# Altium schematic sheet FPGA_165B_DigitizedSound.SchDoc
size B; Organization: Altium Limited; Address1: L3, 12a Rodborough Rd; Address2: Frenchs Forest; Address3: NSW; Address4: Australia 2086; DocumentNumber: 1; SheetNumber: 1; SheetTotal: 8
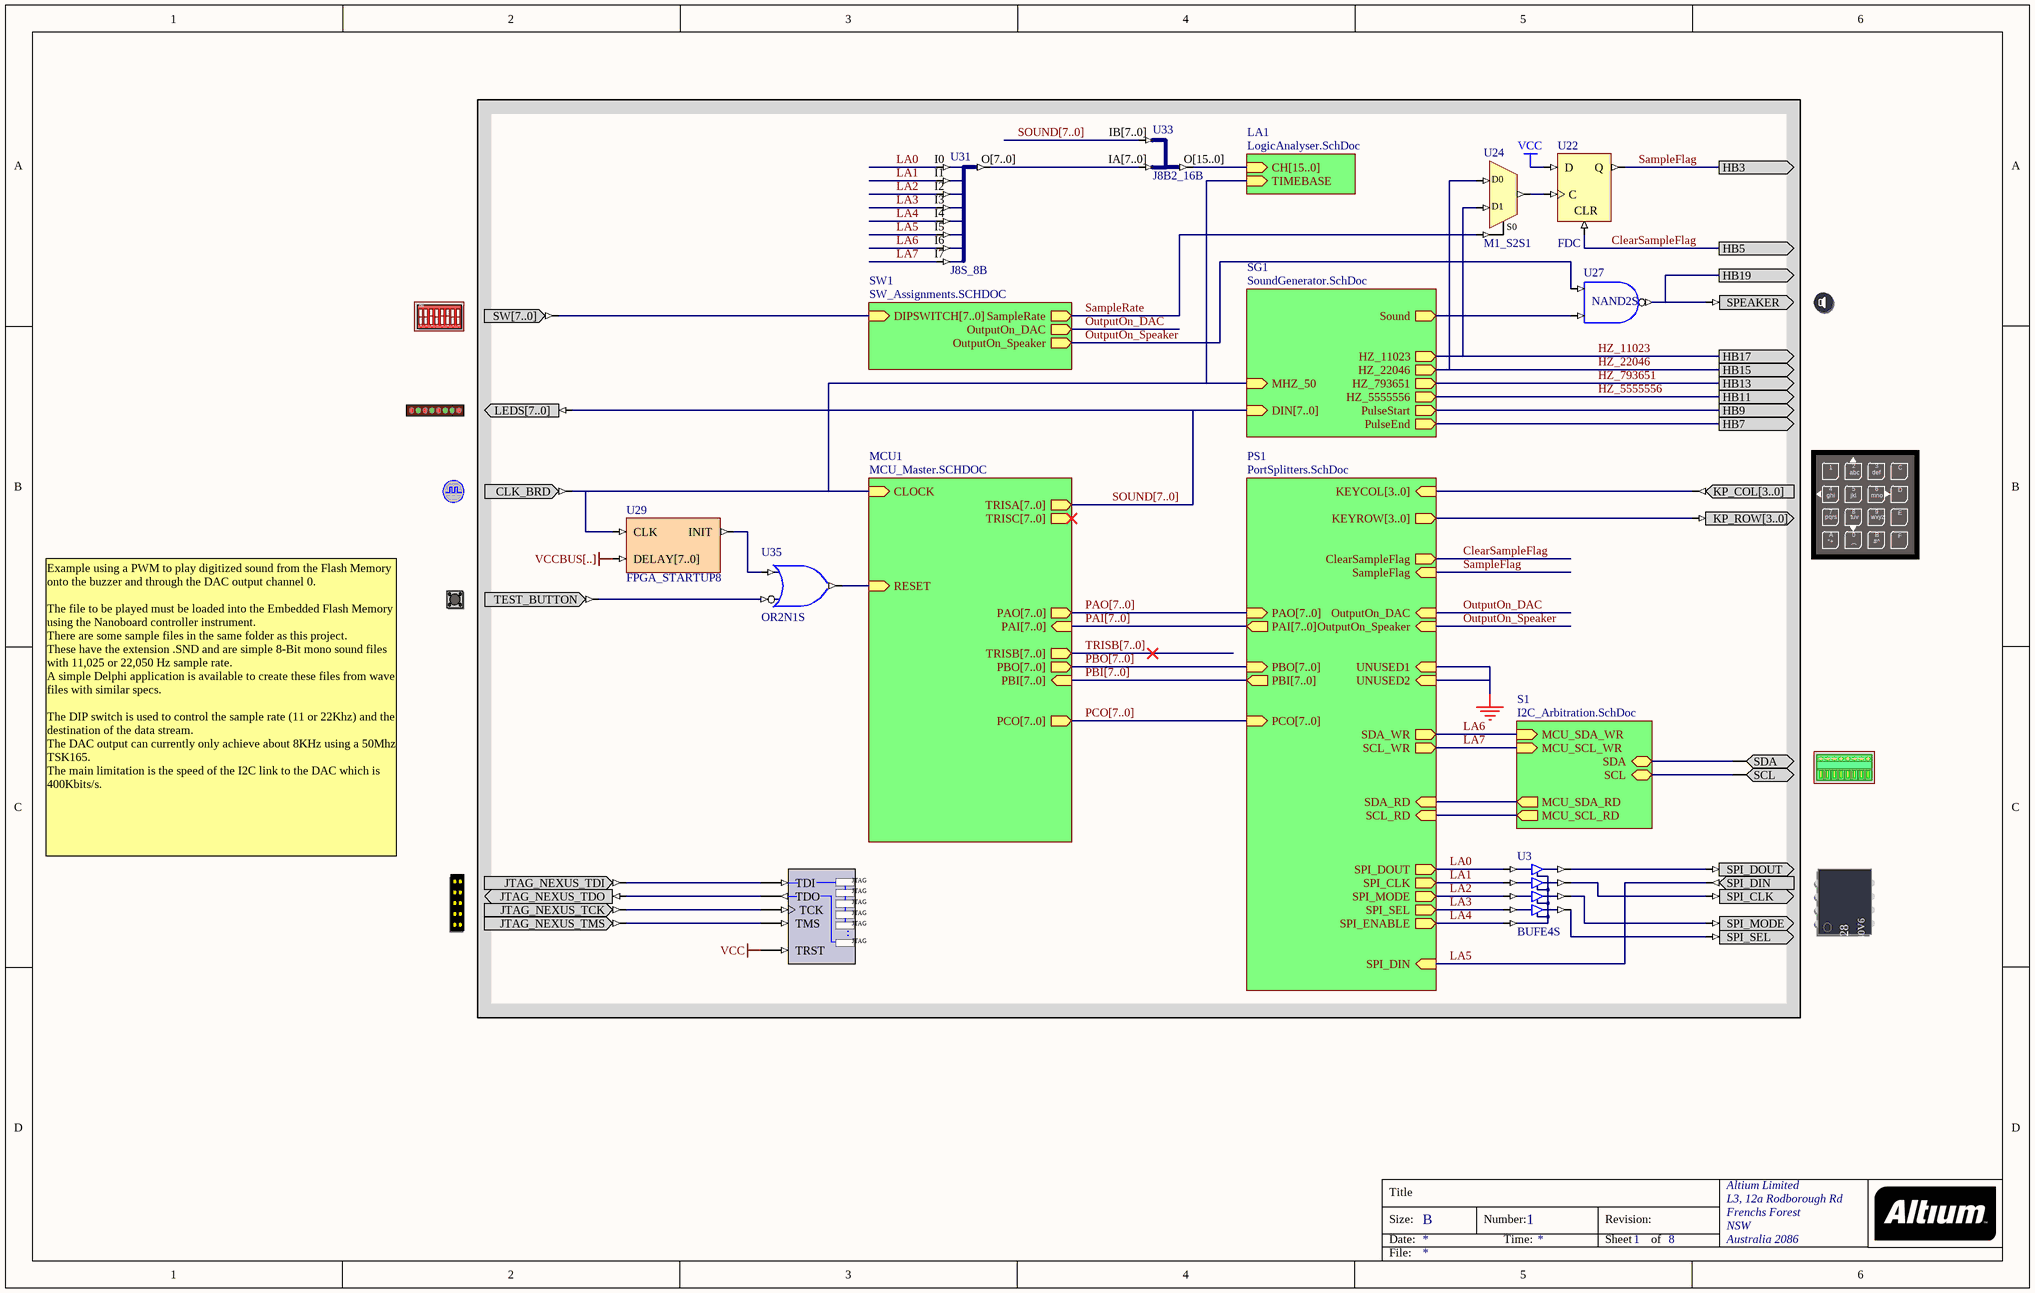
[diagram p0: FPGA_165B_DigitizedSound.SchDoc]

## Parts
(Parts that share a designator on the sheet are numbered #1, #2 ... from top to bottom, then left to right.)
?#1  SPEAKER  (value not drawn)
?#2  DIPSWITCH  (value not drawn)
?#3  LED  (value not drawn)
?#4  KEYPAD  (value not drawn)
?#5  CLOCK_BOARD  (value not drawn)
?#6  TEST_BUTTON  (value not drawn)
?#7  ADCDAC_I2C  (value not drawn)
?#8  SERIALFMEMORY  (value not drawn)
?#9  NEXUS_JTAG_CONNECTOR  (value not drawn)
NEXUS_JTAG_PORT  NEXUS_JTAG_PORT  (value not drawn)
U3  BUFE4S
U22  FDC
U24  M1_S2S1
U27  NAND2S
U29  FPGA_STARTUP8
U31  J8S_8B
U33  J8B2_16B
U35  OR2N1S

## Sub-sheets
LA1 = LogicAnalyser.SchDoc: CH[15..0] (in), TIMEBASE (in)
MCU1 = MCU_Master.SCHDOC: CLOCK (in), RESET (in), PAI[7..0] (in), PBI[7..0] (in), PAO[7..0] (out), TRISB[7..0] (out), PBO[7..0] (out), PCO[7..0] (out), TRISA[7..0] (out), TRISC[7..0] (out)
PS1 = PortSplitters.SchDoc: SDA_RD (in), SampleFlag (in), SCL_RD (in), OutputOn_DAC (in), OutputOn_Speaker (in), SPI_DIN (in), SDA_WR (out), SCL_WR (out), ClearSampleFlag (out), SPI_ENABLE (out), SPI_CLK (out), SPI_MODE (out), SPI_SEL (out), SPI_DOUT (out), PCO[7..0] (in), PBI[7..0] (out), UNUSED1 (in), UNUSED2 (in), PAI[7..0] (out), PAO[7..0] (in), PBO[7..0] (in), KEYCOL[3..0] (in), KEYROW[3..0] (out)
S1 = I2C_Arbitration.SchDoc: SDA (bidir), SCL (bidir), MCU_SCL_RD (out), MCU_SDA_WR (in), MCU_SCL_WR (in), MCU_SDA_RD (out)
SG1 = SoundGenerator.SchDoc: HZ_5555556 (out), Sound (out), HZ_22046 (out), HZ_793651 (out), PulseStart (out), PulseEnd (out), MHZ_50 (in), DIN[7..0] (in), HZ_11023 (out)
SW1 = SW_Assignments.SCHDOC: DIPSWITCH[7..0] (in), SampleRate (out), OutputOn_DAC (out), OutputOn_Speaker (out)

## Ports
HB3 (out), HB5 (out), HB7 (out), HB9 (out), HB11 (out), HB13 (out), HB15 (out), HB17 (out), HB19 (out)

## Nets
GND: sheet PS1/UNUSED1, sheet PS1/UNUSED2
VCC: NEXUS_JTAG_PORT.TRST U22.D
VCCBUS[..]: U29.DELAY[7..0]
ClearSampleFlag: U22.CLR ; port HB5, sheet PS1/ClearSampleFlag
HB7: port HB7, sheet SG1/PulseEnd
HB9: port HB9, sheet SG1/PulseStart
HB19: ?#1.SPEAKER U27.O ; port HB19
HZ_11023: U24.D1 ; port HB17, sheet SG1/HZ_11023
HZ_22046: U24.D0 ; port HB15, sheet SG1/HZ_22046
HZ_793651: port HB13, sheet SG1/HZ_793651
HZ_5555556: port HB11, sheet SG1/HZ_5555556
LA0: U3.I3 U31.I0 ; sheet PS1/SPI_DOUT
LA1: U3.I2 U31.I1 ; sheet PS1/SPI_CLK
LA2: U3.I1 U31.I2 ; sheet PS1/SPI_MODE
LA3: U3.I0 U31.I3 ; sheet PS1/SPI_SEL
LA4: U3.E U31.I4 ; sheet PS1/SPI_ENABLE
LA5: ?#8.SPI_DIN U31.I5 ; sheet PS1/SPI_DIN
LA6: U31.I6 ; sheet S1/MCU_SDA_WR, sheet PS1/SDA_WR
LA7: U31.I7 ; sheet S1/MCU_SCL_WR, sheet PS1/SCL_WR
OutputOn_DAC: sheet PS1/OutputOn_DAC, sheet SW1/OutputOn_DAC
OutputOn_Speaker: U27.I0 ; sheet PS1/OutputOn_Speaker, sheet SW1/OutputOn_Speaker
SampleFlag: U22.Q ; port HB3, sheet PS1/SampleFlag
SampleRate: U24.S0 ; sheet SW1/SampleRate
SOUND[7..0]: ?#3.LEDS[7..0] U33.IB[7..0] ; sheet SG1/DIN[7..0], sheet MCU1/TRISA[7..0]
Net?#2_SW[7..0]: ?#2.SW[7..0] ; sheet SW1/DIPSWITCH[7..0]
Net?#4_KP_COL[3..0]: ?#4.KP_COL[3..0] ; sheet PS1/KEYCOL[3..0]
Net?#4_KP_ROW[3..0]: ?#4.KP_ROW[3..0] ; sheet PS1/KEYROW[3..0]
Net?#5_CLK_BRD: ?#5.CLK_BRD U29.CLK ; sheet SG1/MHZ_50, sheet MCU1/CLOCK, sheet LA1/TIMEBASE
Net?#6_TEST_BUTTON: ?#6.TEST_BUTTON U35.I0
Net?#7_SCL: ?#7.SCL ; sheet S1/SCL
Net?#7_SDA: ?#7.SDA ; sheet S1/SDA
Net?#8_SPI_CLK: ?#8.SPI_CLK U3.O2
Net?#8_SPI_DOUT: ?#8.SPI_DOUT U3.O3
Net?#8_SPI_MODE: ?#8.SPI_MODE U3.O1
Net?#8_SPI_SEL: ?#8.SPI_SEL U3.O0
Net?#9_JTAG_NEXUS_TCK: ?#9.JTAG_NEXUS_TCK NEXUS_JTAG_PORT.TCK
Net?#9_JTAG_NEXUS_TDI: ?#9.JTAG_NEXUS_TDI NEXUS_JTAG_PORT.TDI
Net?#9_JTAG_NEXUS_TDO: ?#9.JTAG_NEXUS_TDO NEXUS_JTAG_PORT.TDO
Net?#9_JTAG_NEXUS_TMS: ?#9.JTAG_NEXUS_TMS NEXUS_JTAG_PORT.TMS
NetU22_C: U22.C U24.O
NetU27_I1: U27.I1 ; sheet SG1/Sound
NetU29_INIT: U29.INIT U35.I1
NetU31_O[7..0]: U31.O[7..0] U33.IA[7..0]
NetU33_O[15..0]: U33.O[15..0] ; sheet LA1/CH[15..0]
NetU35_O: U35.O ; sheet MCU1/RESET
(unnamed): sheet S1/MCU_SCL_RD, sheet PS1/SCL_RD
(unnamed): sheet S1/MCU_SDA_RD, sheet PS1/SDA_RD

## Buses and harness runs
bus PAI[7..0] = sheet MCU1/PAI[7..0] = sheet PS1/PAI[7..0]
bus PAO[7..0] = sheet MCU1/PAO[7..0] = sheet PS1/PAO[7..0]
bus PBI[7..0] = sheet MCU1/PBI[7..0] = sheet PS1/PBI[7..0]
bus PBO[7..0] = sheet MCU1/PBO[7..0] = sheet PS1/PBO[7..0]
bus PCO[7..0] = sheet MCU1/PCO[7..0] = sheet PS1/PCO[7..0]
bus SOUND[7..0]
bus SOUND[7..0] = sheet MCU1/TRISA[7..0] = sheet SG1/DIN[7..0]
bus TRISB[7..0] = sheet MCU1/TRISB[7..0]

## Notes on the sheet
- Example using a PWM to play digitized sound from the Flash Memory onto the buzzer and through the DAC output channel 0.
  The file to be played must be loaded into the Embedded Flash Memory using the Nanoboard controller instrument.
  There are some sample files in the same folder as this project.
  These have the extension .SND and are simple 8-Bit mono sound files with 11,025 or 22,050 Hz sample rate.
  A simple Delphi application is available to create these files from wave files with similar specs.
  The DIP switch is used to control the sample rate (11 or 22Khz) and the destination of the data stream.
  The DAC output can currently only achieve about 8KHz using a 50Mhz TSK165.
  The main limitation is the speed of the I2C link to the DAC which is 400Kbits/s.
- Title
- Size:
- Date:
- B
- Number:
- Time:
- Revision:
- Sheet
- of
- File:
- (in symbol DIPSWITCH) ON; 1; 2; 3; 4; 5; 6; 7; 8
- (in symbol KEYPAD) 1; 2; 3; C; abc; def; 4; 5; 6; ghi; jkl; mno; D; 7; 8; 9; E; pqrs; tuv; wxyz; A; 0; B; F; *+; (; #^
- (in symbol NEXUS_JTAG_PORT) JTAG; .
- (in symbol SERIALFMEMORY) 2SP40V6; ST 93228

## Library data of the parts
?#1 = SPEAKER: Sound interface; PortComponent: True; Published: 19-Nov-2003; Publisher: Altium Limited
?#2 = DIPSWITCH: 8-Way Dip Switch; PortComponent: True; Published: 19-Nov-2003; Publisher: Altium Limited
?#3 = LED: 8-Way LEDS; PortComponent: True; Published: 19-Nov-2003; Publisher: Altium Limited
?#4 = KEYPAD: Key Pad; PortComponent: True; Published: 19-Nov-2003; Publisher: Altium Limited
?#5 = CLOCK_BOARD: Global System Clock Supply; PortComponent: True; Published: 19-Nov-2003; Publisher: Altium Limited
?#6 = TEST_BUTTON: Test Button; PortComponent: True; Published: 19-Nov-2003; Publisher: Altium Limited
?#7 = ADCDAC_I2C: Analog Digital/ Digital Analog Converter, I2C Interface; PortComponent: True; Published: 19-Nov-2003; Publisher: Altium Limited
?#8 = SERIALFMEMORY: Serial Flash Memory; PortComponent: True; Published: 19-Nov-2003; Publisher: Altium Limited
?#9 = NEXUS_JTAG_CONNECTOR: JTAG Port; PortComponent: True; Published: 19-Nov-2003; Publisher: Altium Limited
NEXUS_JTAG_PORT = NEXUS_JTAG_PORT: Soft Nexus-Chain Connector; NEXUS_JTAG_CONNECTOR: True; Published: 18-Dec-2003; Publisher: Altium Limited
U3 = BUFE4S: 4-Bit 3-state Buffer with Active High Enable, Single Pin Version; Xilinx Equivalent: BUFE4; ArchiveName: GENERIC; Published: 18-Dec-2003; Publisher: Altium Limited; Core Revision: 1.00.00
U22 = FDC: D-Type Flip-Flop with Asynchronous Clear; ArchiveName: GENERIC; Published: 18-Dec-2003; Publisher: Altium Limited; Xilinx Equivalent: FDC; Core Revision: 1.00.00
U24 = M1_S2S1: 2x1-Single Wire to 1x1-Single Wire Multiplexer; Xilinx Equivalent: M2_1; ArchiveName: GENERIC; Published: 18-Nov-2003; Publisher: Altium Limited; Core Revision: 1.00.00
U27 = NAND2S: 2-Input NAND Gate, Single Pin Version; Xilinx Equivalent: NAND2; ArchiveName: GENERIC; Published: 18-Nov-2003; Publisher: Altium Limited; Core Revision: 1.00.00
U29 = FPGA_STARTUP8: FPGA Startup With 8 Bit Delay; Published: 21/01/2004; Publisher: Altium Hobart Technology Centre; Core Revision: 1.00.00
U31 = J8S_8B: 8 Single pin inputs to single 8-Bit output bus; ArchiveName: GENERIC; Published: 18-Nov-2003; Publisher: Altium Limited; Core Revision: 1.00.00
U33 = J8B2_16B: 2 x 8-Bit input bus to 1 x 16-bit output bus; ArchiveName: GENERIC; Published: 18-Nov-2003; Publisher: Altium Limited; Core Revision: 1.00.00
U35 = OR2N1S: 2-Input OR Gate with Active Low A Input, Single Pin Version; Xilinx Equivalent: OR2B1; ArchiveName: GENERIC; Published: 18-Dec-2003; Publisher: Altium Limited; Core Revision: 1.00.00